# EAGLE design 076-000a (EAGLE 5.03)
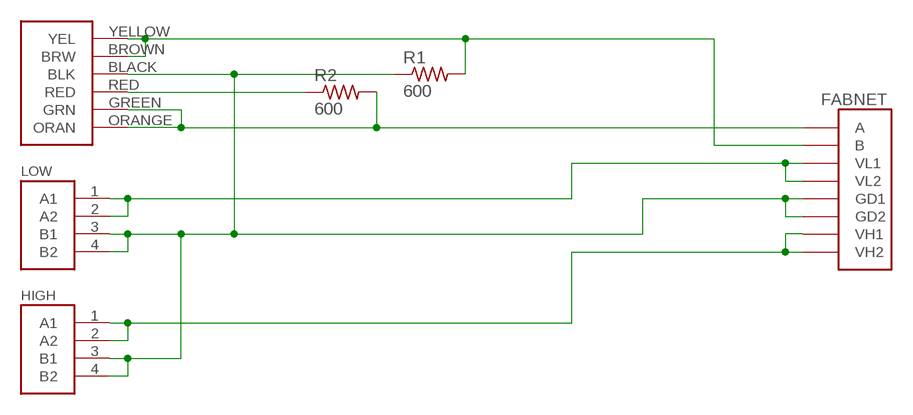
[diagram p0: schematic, sheet 1]

## Parts
FABNET  IO_HEADER  [IO_HEADER]
HIGH  DC_MOTOR_HEADER  [2X2HEADER]
LOW  DC_MOTOR_HEADER  [2X2HEADER]
R1  600  R-US_R1206  [R1206]
R2  600  R-US_R1206  [R1206]
U$4  FABNET_PADS  [FABNET_PADS]

## Nets
N$1: FABNET.7(VH1) FABNET.8(VH2) HIGH.1(A1) HIGH.2(A2)
N$3: FABNET.3(VL1) FABNET.4(VL2) LOW.1(A1) LOW.2(A2)
N$4: FABNET.1(A) R2.2 U$4.GREEN(GRN) U$4.ORANGE(ORAN)
N$5: R2.1 U$4.RED
N$6: FABNET.2(B) R1.2 U$4.BROWN(BRW) U$4.YELLOW(YEL)
N$7: FABNET.5(GD1) FABNET.6(GD2) HIGH.3(B1) HIGH.4(B2) LOW.3(B1) LOW.4(B2) R1.1 U$4.BLACK(BLK)

## Library data of the parts
FABNET = MtMM:IO_HEADER
HIGH LOW = MtMM:DC_MOTOR_HEADER
R1 R2 = rcl:R-US_: RESISTOR, American symbol
U$4 = MtMM:FABNET_PADS

## Board
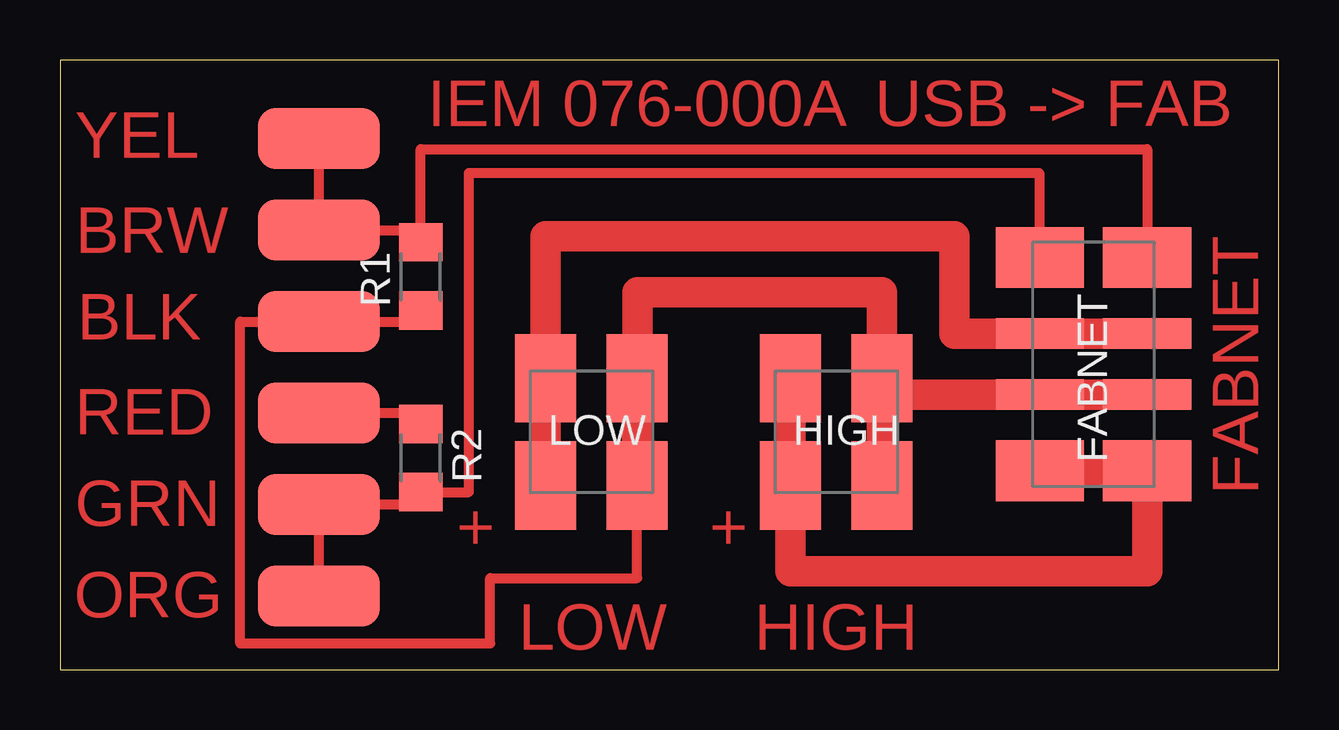
[diagram p1: board, top side]

Size 50.8 x 25.4 mm. Coordinates in mm from the lower left corner, seen from the top.
Outline: 0,0 50.8,0 50.8,25.4 0,25.4 0,0
Copper layers (1*16): Top 0.035mm / dielectric 1.5mm / Bottom 0.035mm
Design rules "default": minimum track width 10mil, minimum drill 24mil, track to track 8mil, track to pad 8mil, pad to pad 8mil, via to via 8mil, smd to smd 8mil, copper to edge 40mil, drill to drill 8mil, minimum pad ring 10mil, minimum via ring 8mil, stop-mask expansion 4mil, vias tented up to drill 0mil, thermal gap 10mil

### Footprints (pad centres in the part's own frame; a part is rotated, then mirrored left to right if it is on the bottom)
IO_HEADER = smd 2.54 x 3.683: 1 -3.175,-2.235; 2 -3.175,2.235; 7 5.715,-2.235; 8 5.715,2.235 | smd 1.27 x 3.683: 3 0,-2.235; 4 0,2.235; 5 2.54,-2.235; 6 2.54,2.235
2X2HEADER = smd 2.54 x 3.683: 1 -1.905,-2.235; 2 -1.905,2.235; 3 1.905,-2.235; 4 1.905,2.235
R1206 = smd 1.6 x 1.803: 1 -1.422,0; 2 1.422,0
FABNET_PADS = smd 5.08 x 2.54: BLACK 0,2.54; BROWN 0,6.35; GREEN 0,-5.08; ORANGE 0,-8.89; RED 0,-1.27; YELLOW 0,10.16

### Placement (x,y rotation side)
FABNET  43.08,14 270 top
HIGH  32.36,9.91 0 top
LOW  22.15,9.91 0 top
R1  15.04,16.38 90 top
R2  15.04,8.81 270 top
U$4  10.79,11.96 0 top

### Tracks (layer width: path | path; a pad name or v marks a point on that pad's centre or on a via)
N$1
  Top 1.27: FABNET.7 FABNET.8 45.31,4.09 30.45,4.09 HIGH.1 HIGH.2
N$3
  Top 1.27: FABNET.4 FABNET.3 37.29,13.99 37.29,18.06 20.24,18.06 LOW.2 LOW.1
N$4
  Top 0.406: U$4.ORANGE U$4.GREEN 15.04,6.88 R2.2 17.04,7.39 17.04,20.7 40.82,20.7 40.82,17.17 FABNET.1
N$5
  Top 0.406: U$4.RED 15.04,10.69 R2.1
N$6
  Top 0.406: 15.04,18.31 R1.2 | U$4.YELLOW U$4.BROWN 15.04,18.31 | FABNET.2 45.31,21.69 15.04,21.69 15.04,18.31
N$7
  Top 0.406: R1.1 15.04,14.5 U$4.BLACK 7.52,14.5 7.52,1.09 17.93,1.09 17.93,3.81 24.05,3.81 LOW.3
  Top 1.27: FABNET.6 FABNET.5 34.27,11.46 HIGH.4 | 34.27,12.8 HIGH.4 | 34.27,12.8 34.27,13.34 | HIGH.4 HIGH.3 | LOW.3 LOW.4 24.08,15.72 34.27,15.72 34.27,12.8

### Text on the board
Top: IEM 076-000A | USB -> FAB | YEL | BRW | BLK | RED | FABNET | GRN | + | + | ORG | LOW | HIGH